# EAGLE design led (EAGLE 6.6.0)
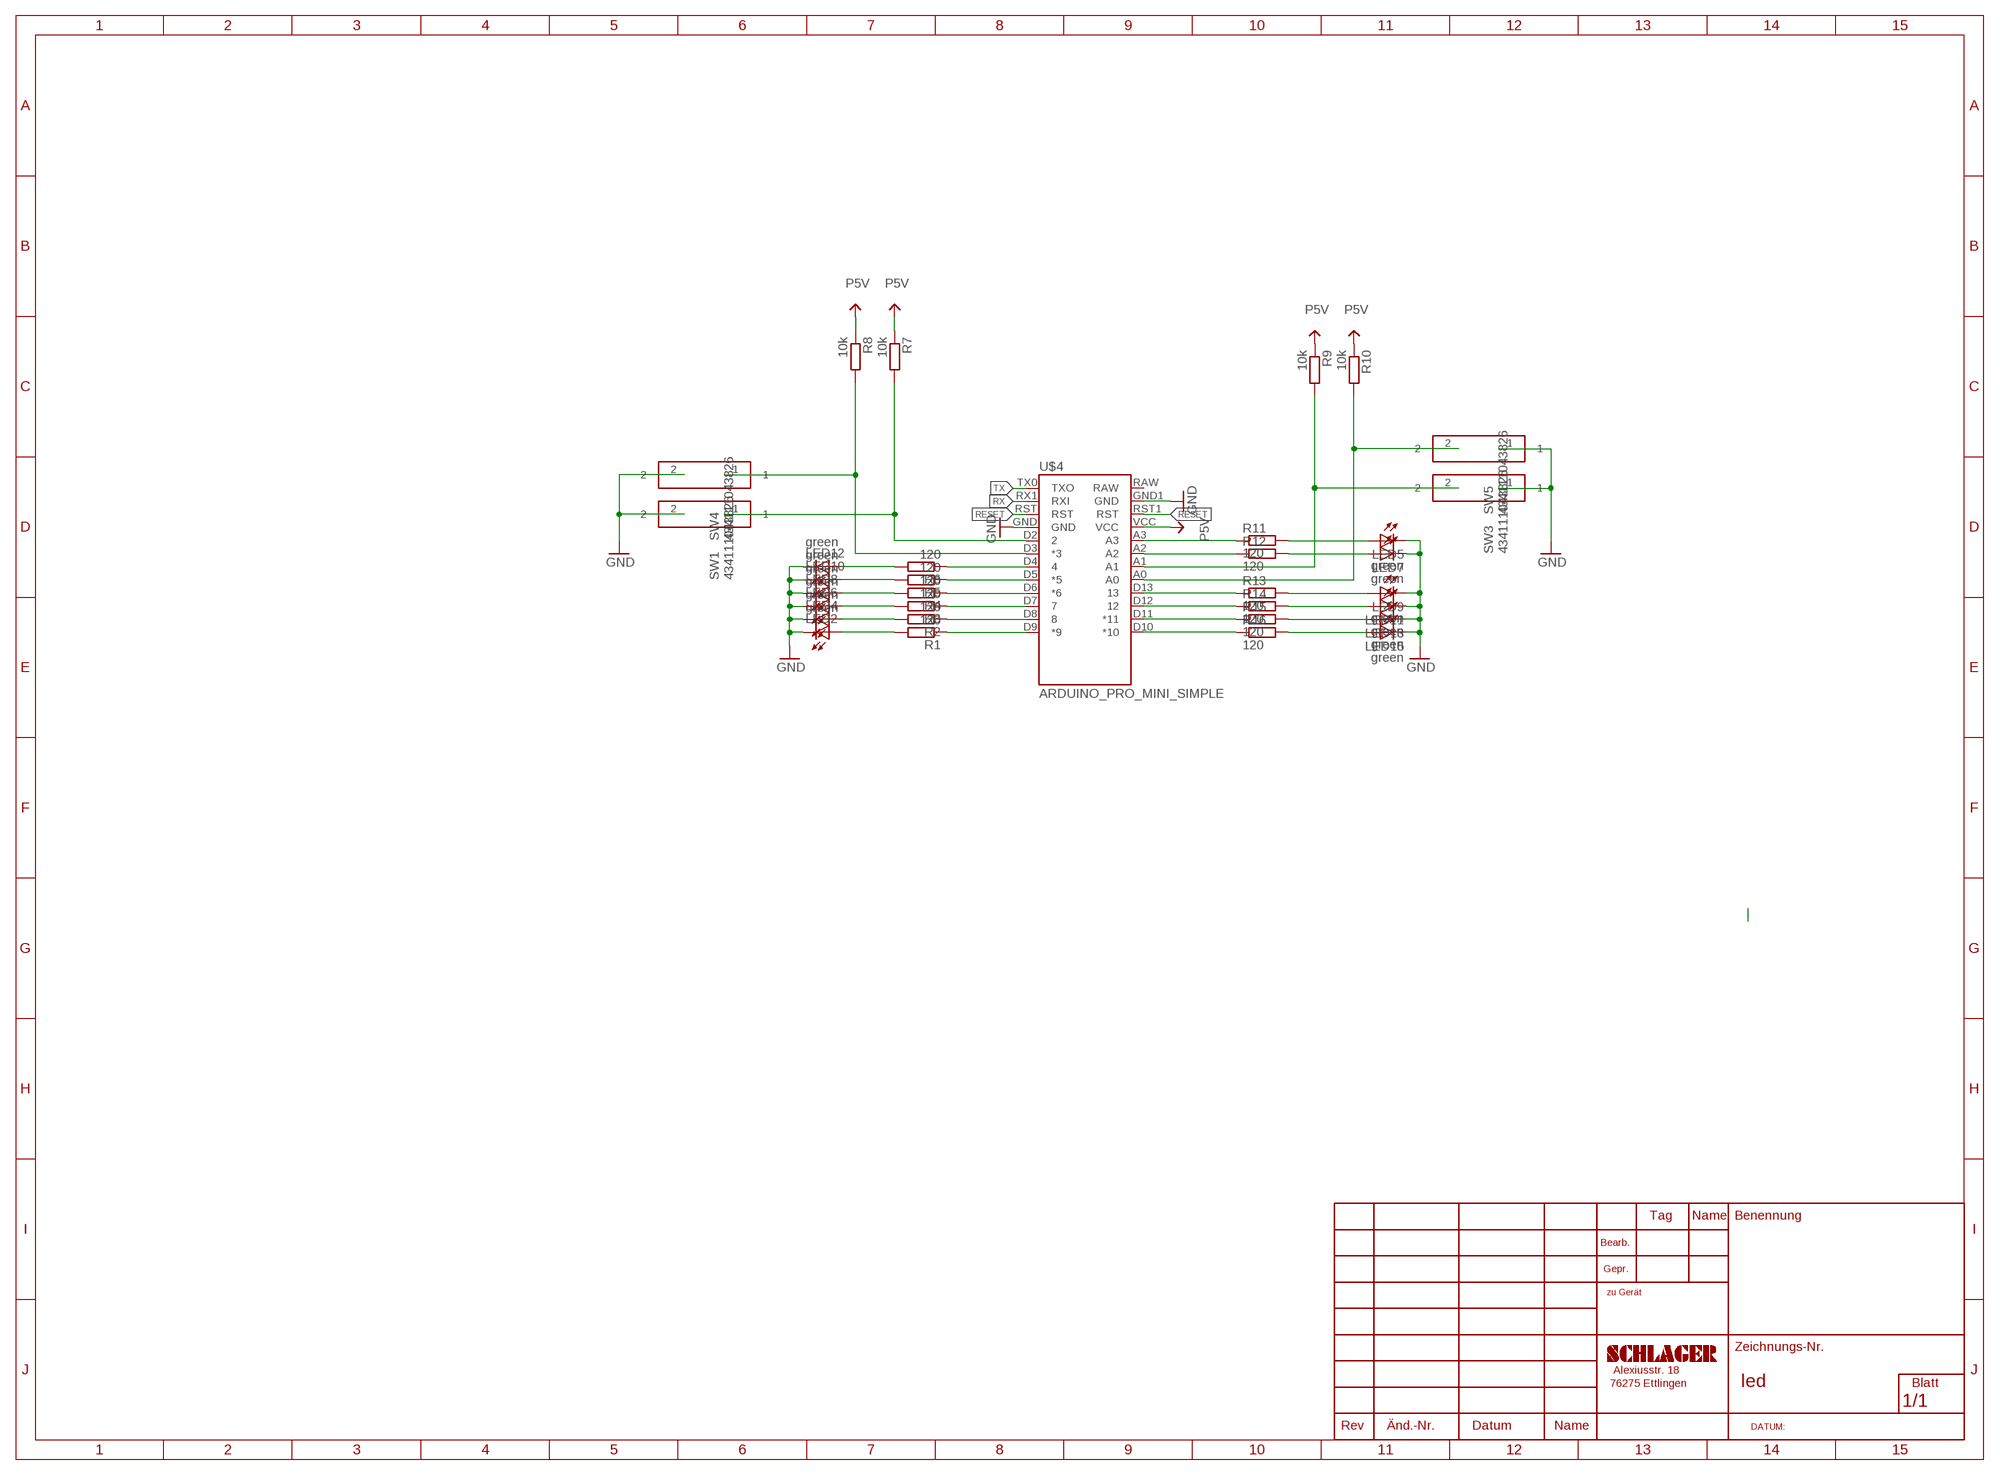
[diagram p0: schematic, sheet 1]

## Parts
LED2  green  LEDCHIPLED_0805  [CHIPLED_0805]
LED4  green  LEDCHIPLED_0805  [CHIPLED_0805]
LED5  green  LEDCHIPLED_0805  [CHIPLED_0805]
LED6  green  LEDCHIPLED_0805  [CHIPLED_0805]
LED7  green  LEDCHIPLED_0805  [CHIPLED_0805]
LED8  green  LEDCHIPLED_0805  [CHIPLED_0805]
LED9  green  LEDCHIPLED_0805  [CHIPLED_0805]
LED10  green  LEDCHIPLED_0805  [CHIPLED_0805]
LED11  green  LEDCHIPLED_0805  [CHIPLED_0805]
LED12  green  LEDCHIPLED_0805  [CHIPLED_0805]
LED13  green  LEDCHIPLED_0805  [CHIPLED_0805]
LED15  green  LEDCHIPLED_0805  [CHIPLED_0805]
R1  120  R-EU_R0805  [R0805]
R2  120  R-EU_R0805  [R0805]
R3  120  R-EU_R0805  [R0805]
R4  120  R-EU_R0805  [R0805]
R5  120  R-EU_R0805  [R0805]
R6  120  R-EU_R0805  [R0805]
R7  10k  R-EU_R0805  [R0805]
R8  10k  R-EU_R0805  [R0805]
R9  10k  R-EU_R0805  [R0805]
R10  10k  R-EU_R0805  [R0805]
R11  120  R-EU_R0805  [R0805]
R12  120  R-EU_R0805  [R0805]
R13  120  R-EU_R0805  [R0805]
R14  120  R-EU_R0805  [R0805]
R15  120  R-EU_R0805  [R0805]
R16  120  R-EU_R0805  [R0805]
SW1  434111043826  [434111043826]
SW3  434111043826  [434111043826]
SW4  434111043826  [434111043826]
SW5  434111043826  [434111043826]
U$4  ARDUINO_PRO_MINI_SIMPLE  [PRO_MINI_SIMPLE]

## Nets
GND: LED2.C LED4.C LED5.C LED6.C LED7.C LED8.C LED9.C LED10.C LED11.C LED12.C LED13.C LED15.C SW1.2 SW3.1 SW4.2 SW5.1 U$4.GND U$4.GND1(GND)
N$1: R7.2 SW1.1 U$4.D2
N$2: R8.2 SW4.1 U$4.D3(*3)
N$3: LED5.A R11.2
N$4: LED7.A R12.2
N$5: LED9.A R13.2
N$6: LED11.A R14.2
N$7: LED13.A R15.2
N$8: LED15.A R16.2
N$9: R11.1 U$4.A3
N$10: R12.1 U$4.A2
N$11: R9.2 SW3.2 U$4.A1
N$12: R10.2 SW5.2 U$4.A0
N$14: R13.1 U$4.D13
N$15: R14.1 U$4.D12
N$16: R15.1 U$4.D11(*11)
N$17: R16.1 U$4.D10(*10)
N$18: LED2.A R1.2
N$19: LED4.A R2.2
N$20: LED6.A R3.2
N$21: LED8.A R4.2
N$22: LED10.A R5.2
N$23: LED12.A R6.2
N$26: R1.1 U$4.D9(*9)
N$27: R2.1 U$4.D8
N$28: R3.1 U$4.D7
N$29: R4.1 U$4.D6(*6)
N$30: R5.1 U$4.D5(*5)
N$31: R6.1 U$4.D4
P5V: R7.1 R8.1 R9.1 R10.1 U$4.VCC
RESET: U$4.RST U$4.RST1(RST)
RX: U$4.RX1(RXI)
TX: U$4.TX0(TXO)
Unconnected: U$4.RAW

## Library data of the parts
LED2 LED4-LED13 LED15 = led:LED: LED OSRAM: - CHIPLED LG R971, LG N971, LY N971, LG Q971, LY Q971, LO R971, LY R971 LH N974, LH R974 LS Q976, LO Q976, LY Q976 LO Q996 - Hyper CHIPLED LW Q18S LB Q993, LB Q99A, LB R99A - SideLED LS A670, LO A670, LY A670, LG A670, LP A670 LB A673, LV A673, LT A673, LW A673 LH A674 LY A675 LS A676, LA A676, LO A676, LY A676, LW A676 LS A679, LY A679, LG A679 - Hyper Micro SIDELED® LS Y876, LA Y876, LO Y876, LY Y876 LT Y87S - SmartLED LW L88C, LW L88S LB L89C, LB L89S, LG L890 LS L89K, LO L89K, LY L89K LS L896, LA L896, LO L896, LY L896 - TOPLED LS T670, LO T670, LY T670, LG T670, LP T670 LSG T670, LSP T670, LSY T670, LOP T670, LYG T670 LG T671, LOG T671, LSG T671 LB T673, LV T673, LT T673, LW T673 LH T674 LS T676, LA T676, LO T676, LY T676, LB T676, LH T676, LSB T676, LW T676 LB T67C, LV T67C, LT T67C, LS T67K, LO T67K, LY T67K, LW E67C LS E67B, LA E67B, LO E67B, LY E67B, LB E67C, LV E67C, LT E67C LW T67C LS T679, LY T679, LG T679 LS T770, LO T770, LY T770, LG T770, LP T770 LB T773, LV T773, LT T773, LW T773 LH T774 LS E675, LA E675, LY E675, LS T675 LS T776, LA T776, LO T776, LY T776, LB T776 LHGB T686 LT T68C, LB T68C - Hyper Mini TOPLED® LB M676 - Mini TOPLED Santana® LG M470 LS M47K, LO M47K, LY M47K Source: http://www.osram.convergy.de LUXEON: - LUMILED® LXK2-PW12-R00, LXK2-PW12-S00, LXK2-PW14-U00, LXK2-PW14-V00 LXK2-PM12-R00, LXK2-PM12-S00, LXK2-PM14-U00 LXK2-PE12-Q00, LXK2-PE12-R00, LXK2-PE12-S00, LXK2-PE14-T00, LXK2-PE14-U00 LXK2-PB12-K00, LXK2-PB12-L00, LXK2-PB12-M00, LXK2-PB14-N00, LXK2-PB14-P00, LXK2-PB14-Q00 LXK2-PR12-L00, LXK2-PR12-M00, LXK2-PR14-Q00, LXK2-PR14-R00 LXK2-PD12-Q00, LXK2-PD12-R00, LXK2-PD12-S00 LXK2-PH12-R00, LXK2-PH12-S00 LXK2-PL12-P00, LXK2-PL12-Q00, LXK2-PL12-R00 Source: www.luxeon.com KINGBRIGHT: KA-3528ASYC Source: www.kingbright.com
R1-R16 = rcl:R-EU_: RESISTOR, European symbol
SW1 SW3-SW5 = Wuerth_Elektronik_Switch:434111043826: WS-TRS-6x3.5 mm SMD Tact Switch, 2 pins
U$4 = debauer_modules:ARDUINO_PRO_MINI_SIMPLE

## Net classes
4 USBpair: width 0.254 mm, drill 0.406 mm, clearance 0.508 mm

## Board
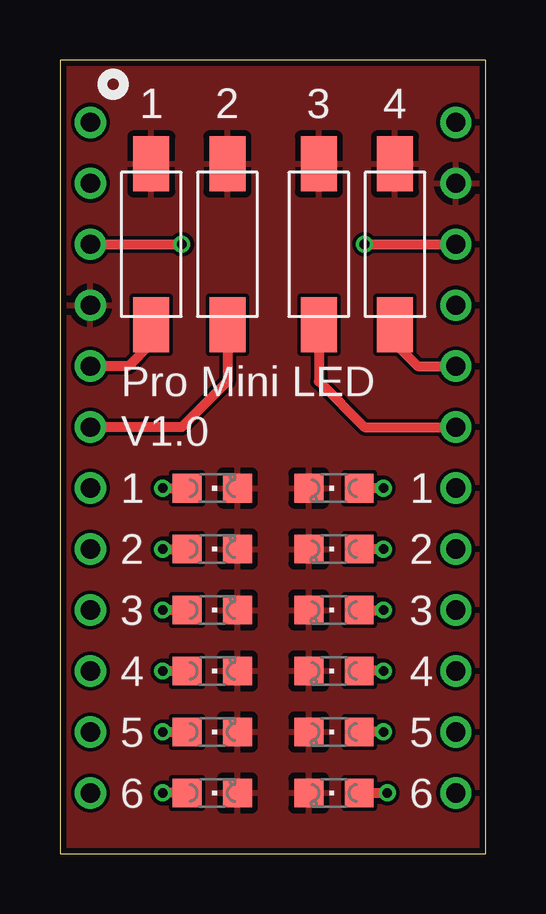
[diagram p1: board, top side]
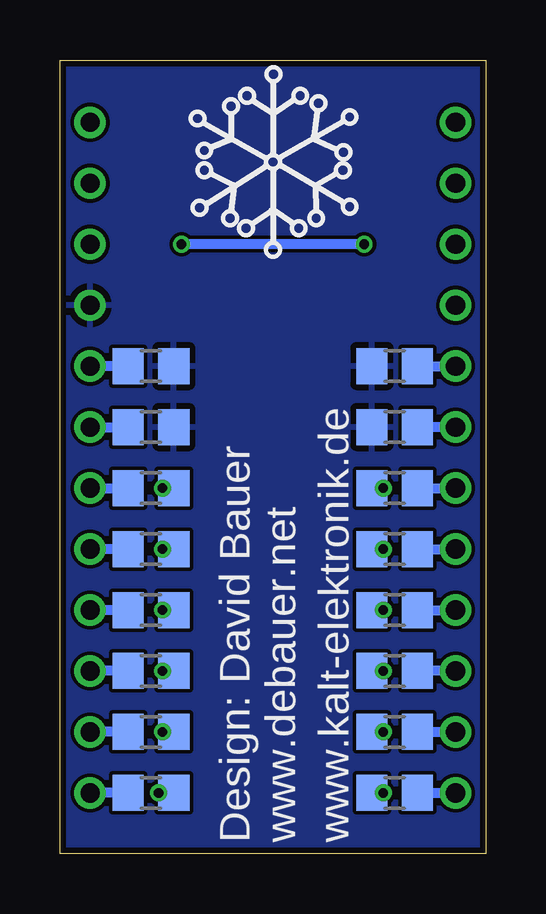
[diagram p2: board, bottom side, seen from below]

Size 17.77 x 33.08 mm. Coordinates in mm from the lower left corner, seen from the top.
Outline: 0,0 17.77,0 17.77,33.08 0,33.08 0,0
Copper layers (1*16): Top 0.035mm / dielectric 1.5mm / Bottom 0.035mm
Design rules "ITEADstudio_DRC": minimum track width 6mil, minimum drill 12mil, track to track 6mil, track to pad 6mil, pad to pad 6mil, via to via 6mil, smd to smd 0mil, copper to edge 10mil, drill to drill 10mil, minimum pad ring 10mil, minimum via ring 6mil, stop-mask expansion 2mil, vias tented up to drill 100mil, thermal gap 10mil

### Footprints (pad centres in the part's own frame; a part is rotated, then mirrored left to right if it is on the bottom)
CHIPLED_0805 = smd 1.2 x 1.2: A 0,-1.05; C 0,1.05
R0805 = smd 1.3 x 1.5: 1 -0.95,0; 2 0.95,0
434111043826 = smd 2.3 x 1.5: 1 -3.35,0; 2 3.35,0
PRO_MINI_SIMPLE = drill 0.8: A0 7.62,3.81; A1 7.62,1.27; A2 7.62,-1.27; A3 7.62,-3.81; D2 -7.62,3.81; D3 -7.62,1.27; D4 -7.62,-1.27; D5 -7.62,-3.81; D6 -7.62,-6.35; D7 -7.62,-8.89; D8 -7.62,-11.43; D9 -7.62,-13.97; D10 7.62,-13.97; D11 7.62,-11.43; D12 7.62,-8.89; D13 7.62,-6.35; GND 7.62,11.43; GND1 -7.62,6.35; RAW 7.62,13.97; RST 7.62,8.89; RST1 -7.62,8.89; RX1 -7.62,11.43; TX0 -7.62,13.97; VCC 7.62,6.35

### Placement (x,y rotation side)
LED2  6.35,2.54 270 top
LED4  6.35,5.08 270 top
LED5  11.43,12.7 90 top
LED6  6.35,7.62 270 top
LED7  11.43,15.24 90 top
LED8  6.35,10.16 270 top
LED9  11.43,10.16 90 top
LED10  6.35,12.7 270 top
LED11  11.43,7.62 90 top
LED12  6.35,15.24 270 top
LED13  11.43,5.08 90 top
LED15  11.43,2.54 90 top
R1  3.81,2.54 180 bottom
R2  3.81,5.08 180 bottom
R3  3.81,7.62 180 bottom
R4  3.81,10.16 180 bottom
R5  3.81,12.7 180 bottom
R6  3.81,15.24 180 bottom
R7  3.81,20.32 0 bottom
R8  3.81,17.78 0 bottom
R9  13.97,17.78 180 bottom
R10  13.97,20.32 180 bottom
R11  13.97,12.7 0 bottom
R12  13.97,15.24 0 bottom
R13  13.97,10.16 0 bottom
R14  13.97,7.62 0 bottom
R15  13.97,5.08 0 bottom
R16  13.97,2.54 0 bottom
SW1  3.81,25.4 90 top
SW3  10.79,25.4 270 top
SW4  6.99,25.4 90 top
SW5  13.97,25.4 270 top
U$1  [SNOW]  8.89,29.21 0 bottom
U$4  8.89,16.51 0 top

### Tracks (layer width: path | path; a pad name or v marks a point on that pad's centre or on a via)
GND
  pour Top: -2.54,34.29 21.59,34.29 21.59,-1.27 -2.54,-1.27
N$1
  Top 0.406: SW1.1 3.81,21.27 R7.2 U$4.D2
  Bottom 0.406: R7.2 U$4.D2
N$2
  Top 0.406: SW4.1 6.99,19.68 5.08,17.78 U$4.D3
  Bottom 0.406: U$4.D3 R8.2
N$3  (via drill 0.4)
  Top 0.406: v13.49,12.7 LED5.A
  Bottom 0.406: R11.2 v13.49,12.7
N$4  (via drill 0.4)
  Top 0.406: v13.49,15.24 LED7.A
  Bottom 0.406: R12.2 v13.49,15.24
N$5  (via drill 0.4)
  Top 0.406: LED9.A v13.49,10.16
  Bottom 0.406: v13.49,10.16 R13.2
N$6  (via drill 0.4)
  Top 0.406: v13.49,7.62 LED11.A
  Bottom 0.406: R14.2 v13.49,7.62
N$7  (via drill 0.4)
  Top 0.406: v13.49,5.08 LED13.A
  Bottom 0.406: R15.2 v13.49,5.08
N$8  (via drill 0.4)
  Top 0.406: LED15.A v13.65,2.54
  Bottom 0.406: v13.65,2.54 R16.2
N$9
  Bottom 0.406: R11.1 U$4.A3
N$10
  Bottom 0.406: U$4.A2 R12.1
N$11
  Top 0.406: SW3.2 10.79,19.68 12.7,17.78 U$4.A1
  Bottom 0.406: U$4.A1 R9.2
N$12
  Top 0.406: SW5.2 13.97,21.27 R10.2 U$4.A0
  Bottom 0.406: R10.2 U$4.A0
N$14
  Bottom 0.406: R13.1 U$4.D13
N$15
  Bottom 0.406: R14.1 U$4.D12
N$16
  Bottom 0.406: R15.1 U$4.D11
N$17
  Bottom 0.406: R16.1 U$4.D10
N$18  (via drill 0.4)
  Top 0.406: LED2.A v4.29,2.54
  Bottom 0.406: v4.29,2.54 R1.2
N$19  (via drill 0.4)
  Top 0.406: v4.29,5.08 LED4.A
  Bottom 0.406: R2.2 v4.29,5.08
N$20  (via drill 0.4)
  Top 0.406: v4.29,7.62 LED6.A
  Bottom 0.406: R3.2 v4.29,7.62
N$21  (via drill 0.4)
  Top 0.406: LED8.A v4.29,10.16
  Bottom 0.406: v4.29,10.16 R4.2
N$22  (via drill 0.4)
  Top 0.406: v4.29,12.7 LED10.A
  Bottom 0.406: R5.2 v4.29,12.7
N$23  (via drill 0.4)
  Top 0.406: v4.29,15.24 LED12.A
  Bottom 0.406: R6.2 v4.29,15.24
N$26
  Bottom 0.406: R1.1 U$4.D9
N$27
  Bottom 0.406: R2.1 U$4.D8
N$28
  Bottom 0.406: U$4.D7 R3.1
N$29
  Bottom 0.406: R4.1 U$4.D6
N$30
  Bottom 0.406: R5.1 U$4.D5
N$31
  Bottom 0.406: R6.1 U$4.D4
P5V
  pour Bottom: -5.08,36.83 24.13,36.83 24.13,-3.81 -5.08,-3.81
RESET  (via drill 0.4)
  Top 0.406: U$4.RST1 v5.08,25.4 | v12.7,25.4 U$4.RST
  Bottom 0.406: v5.08,25.4 v12.7,25.4

### Text on the board
tPlace: 1 | 2 | 3 | 4 | Pro Mini LED | V1.0 | 1 | 1 | 2 | 2 | 3 | 3 | 4 | 4 | 5 | 5 | 6 | 6
bPlace: www.kalt-elektronik.de | www.debauer.net | Design: David Bauer